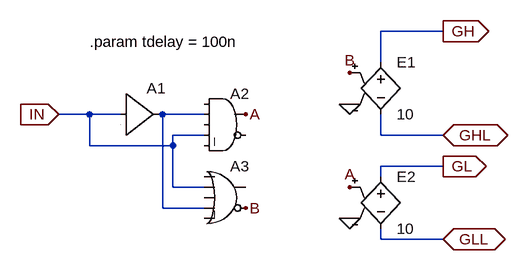
[diagram p0: schematic HBDRV.asc]
HBDRV.asc, the LTspice schematic file:
Version 4
SHEET 1 880 680
WIRE 512 -128 416 -128
WIRE 416 -80 416 -128
WIRE -32 0 -80 0
WIRE 16 0 -32 0
WIRE 144 0 80 0
WIRE 144 32 96 32
WIRE 416 32 416 0
WIRE 512 32 416 32
WIRE -32 48 -32 0
WIRE 96 48 96 32
WIRE 96 48 -32 48
WIRE 512 80 416 80
WIRE 416 96 416 80
WIRE 96 112 96 48
WIRE 144 112 96 112
WIRE 80 144 80 0
WIRE 144 144 80 144
WIRE 416 192 416 176
WIRE 512 192 416 192
FLAG 208 0 A
FLAG 208 144 B
FLAG 512 192 GLL
IOPIN 512 192 BiDir
FLAG 368 -16 0
FLAG 368 160 0
FLAG 368 -64 B
FLAG 368 112 A
FLAG 512 -128 GH
IOPIN 512 -128 Out
FLAG 512 80 GL
IOPIN 512 80 Out
FLAG 512 32 GHL
IOPIN 512 32 BiDir
FLAG -80 0 IN
IOPIN -80 0 In
SYMBOL Digital\\buf1 16 -64 R0
WINDOW 3 8 60 Invisible 2
SYMATTR Value Vhigh=1
SYMATTR InstName A1
SYMATTR Value2 Td={tdelay}
SYMBOL Digital\\and 176 -48 R0
WINDOW 3 16 112 Invisible 2
SYMATTR Value Vhigh=1
SYMATTR InstName A2
SYMBOL Digital\\or 176 64 R0
WINDOW 3 -8 128 Invisible 2
SYMATTR Value Vhigh=1
SYMATTR InstName A3
SYMBOL e 416 -96 R0
SYMATTR InstName E1
SYMATTR Value 10
SYMBOL e 416 80 R0
SYMATTR InstName E2
SYMATTR Value 10
TEXT -32 -112 Left 2 !.param tdelay = 100n

The netlist it stands for:
* HBDRV.asc
A1 IN 0 0 0 0 0 N001 0 BUF Vhigh=1 Td={tdelay}
A2 0 N001 0 IN 0 0 A 0 AND Vhigh=1
A3 0 IN 0 N001 0 B 0 0 OR Vhigh=1
E1 GH GHL B 0 10
E2 GL GLL A 0 10
.param tdelay = 100n
.backanno
.end